# Altium schematic sheet RTC.SchDoc
size 297 x 209 mm; DocumentNumber: 6; SheetNumber: 6
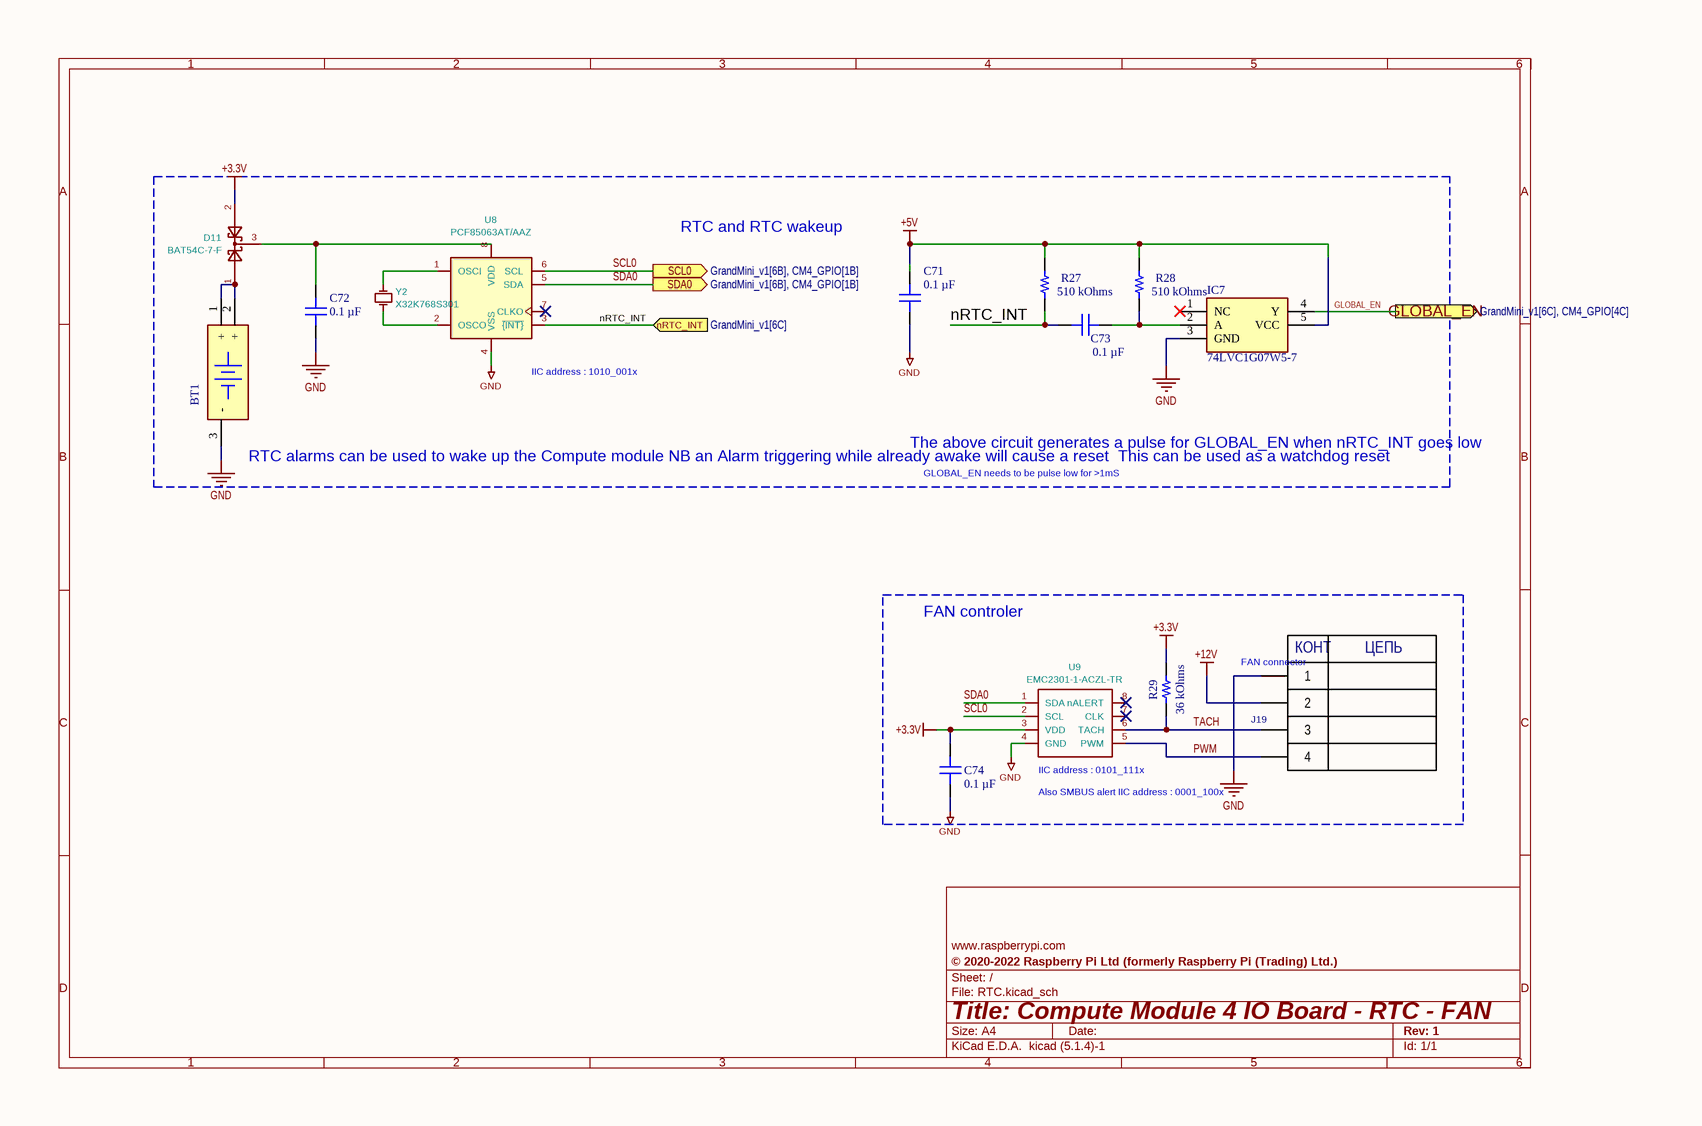
[diagram p0: RTC.SchDoc]

## Parts
BT1  CR2032 Holder  [KLS5CR203204]  (value not drawn)
C71  0.1 µF  [CAP 0603_1608]
C72  0.1 µF  [CAP 0603_1608]
C73  0.1 µF  [CAP 0603_1608]
C74  0.1 µF  [CAP 0603_1608]
D11  BAT54C-7-F  [SOT-23]
IC7  74LVC1G07W5-7  [SOT95P285X140-5N]
J19  WF-4  [WF-4]  (value not drawn)
R27  510 kOhms  [YAGEO RES 0603_1608]
R28  510 kOhms  [YAGEO RES 0603_1608]
R29  36 kOhms  [YAGEO RES 0603_1608]
U8  PCF85063AT/AAZ  [SOIC-8_3.9x4.9mm_P1.27mm]
U9  EMC2301-1-ACZL-TR  [MSOP-8_3x3mm_P0.65mm]
Y2  X32K768S301  [Crystal_SMD_3215-2Pin_3.2x1.5mm]

## Blocks framed on the sheet
RTC and RTC wakeup: BT1 C71-C73 D11 IC7 R27 R28 U8 Y2
FAN controler: C74 J19 R29 U9

## Ports
GLOBAL_EN (out, see GrandMini_v1[6C], CM4_GPIO[4C]), nRTC_INT (in, see GrandMini_v1[6C]), SCL0 (out, see GrandMini_v1[6B], CM4_GPIO[1B]), SDA0 (out, see GrandMini_v1[6B], CM4_GPIO[1B])

## Nets
+3.3V: C74.2 D11.2 R29.1 U9.3(VDD)
+5V: C71.2 IC7.5(VCC) R27.2 R28.2
+12V: J19.2
GND: BT1.3(-) C71.1 C72.1 C74.1 IC7.3(GND) J19.1 U8.4(VSS) U9.4(GND)
GLOBAL_EN: IC7.4(Y) ; port GLOBAL_EN
nRTC_INT: C73.1 R27.1 U8.3(~{{INT}}) ; port nRTC_INT
PWM: J19.4 U9.5(PWM)
SCL0: U8.6(SCL) U9.2(SCL) ; port SCL0
SDA0: U8.5(SDA) U9.1(SDA) ; port SDA0
TACH: J19.3 R29.2 U9.6(TACH)
NetBT1_1: BT1.1(+) BT1.2(+) D11.1
NetC72_2: C72.2 D11.3 U8.8(VDD)
NetC73_2: C73.2 IC7.2(A) R28.1
NetU8_1: U8.1(OSCI) Y2.2
NetU8_2: U8.2(OSCO) Y2.1

Not connected (* = marked no-connect by the designer): IC7 1(NC)*; U8 7(CLKO)*; U9 7(CLK)* 8(nALERT)*

## Notes on the sheet
- (near U8) IIC address : 1010_001x
- (near BT1) RTC alarms can be used to wake up the Compute module
  NB an Alarm triggering while already awake will cause a reset
  This can be used as a watchdog reset
- The above circuit generates a pulse for
  GLOBAL_EN when nRTC_INT goes low
- GLOBAL_EN needs to be pulse low for >1mS
- (near J19) FAN connector
- (near U9) IIC address : 0101_111x
- Also SMBUS alert IIC address : 0001_100x
- 1
- 2
- 3
- 4
- 5
- 6
- A
- B
- C
- www.raspberrypi.com <http://www.raspberrypi.com>
- D
- Title: Compute Module 4 IO Board - RTC - FAN
- File: RTC.kicad_sch
- Sheet: /
- © 2020-2022 Raspberry Pi Ltd (formerly Raspberry Pi (Trading) Ltd.)
- KiCad E.D.A.  kicad (5.1.4)-1
- Size: A4
- Date:
- Rev: 1
- Id: 1/1
- (in symbol WF-4) КОНТ; ЦЕПЬ

## Library data of the parts
BT1 = KLS5-CR2032-04: Battery Holder, Vertical, CR2032; Manufacturer_Name: KLS Electronic; Datasheet Link: http://www.klsele.com/admin/product_upload/20151124101114KLS5-CR2032-04.pdf; Height: 18.13mm; Manufacturer_Part_Number: KLS5-CR2032-04
C71-C74 = CC0603KRX7R9BB104: CAP CER 0.1UF 50V X7R 0603; manufacturer: Yageo; Tolerance: ±10%; Value: 0.1 µF; Part Number: CC0603KRX7R9BB104; Applications: General Purpose; Capacitance: 0.1 µF; componentlink1description: Datasheet; componentlink1url: https://www.yageo.com/upload/media/product/productsearch/datasheet/mlcc/UPY-GPHC_X7R_6.3V-to-50V_18.pdf; componentlink2description: DigiKey Link; componentlink2url: https://www.digikey.com/en/products/detail/yageo/CC0603KRX7R9BB104/2103082; Device Package: 0603 (1608 Metric); lastupdated: 09.02.2024 20:10:21; Lifecycle Status: Active; Minimum Order: 1; Mounting Type: Surface Mount, MLCC; Operating Temperature: -55°C ~ 125°C; Package / Case: 0603 (1608 Metric); packaging: TapeAndReel; partid: 9506; Part Status: Active; price: 0.01; series: CC; Size / Dimension: 0.063" L x 0.031" W (1.60mm x 0.80mm); Supplier 1: DigiKey; Supplier Part Number 1: 311-1344-1-ND; Temperature Coefficient: X7R; Thickness (Max): 0.035" (0.90mm); Voltage - Rated: 50V
D11 = BAT54C: Part Description: Diode Array 1 Pair Common Cathode Schottky 30V 200mA (DC) Surface Mount TO-236-3, SC-59, SOT-23-3; Field4: Farnell; Field5: 2306010; Field7: Rohm; Field6: BAT54C-7-F; Value: BAT54C-7-F; Footprint: Package_TO_SOT_SMD:SOT-23
IC7 = 74LVC1G07W5-7: Integrated Circuit; Manufacturer_Name: Diodes Incorporated; Datasheet Link: https://www.diodes.com//assets/Datasheets/74LVC1G07.pdf; Height: 1.4mm; Manufacturer_Part_Number: 74LVC1G07W5-7; Mouser Part Number: 621-74LVC1G07W5-7; Mouser Price/Stock: https://www.mouser.co.uk/ProductDetail/Diodes-Incorporated/74LVC1G07W5-7?qs=abZ1nkZpTuMhe1bWQEjvtw%3D%3D; Arrow Part Number: 74LVC1G07W5-7; Arrow Price/Stock: https://www.arrow.com/en/products/74lvc1g07w5-7/diodes-incorporated?utm_currency=USD&region=nac
J19 = WF-4: Connector; Manufacturer: Connfly; Part Number: WF-6; Part Number1: DS1070-6 M; System: Connector
R27 R28 = RC0603FR-07510KL: RES 510K OHM 1% 1/10W 0603; Manufacturer: Yageo; Power (Watts): 0.1W, 1/10W; Temperature Coefficient: ±100ppm/°C; Value: 510 kOhms; Part Number: RC0603FR-07510KL; ComponentLink1Description: Datasheet; ComponentLink1URL: https://www.yageo.com/upload/media/product/productsearch/datasheet/rchip/PYu-RC_Group_51_RoHS_L_10.pdf; ComponentLink2Description: DigiKey Link; ComponentLink2URL: https://www.digikey.com/en/products/detail/yageo/RC0603FR-07510KL/727286; Composition: Thick Film; Device Package: 0603 (1608 Metric); Features: Moisture Resistant; Height - Seated (Max): 0.022" (0.55mm); LastUpdated: 25.07.2024 9:19:27; Lifecycle Status: Active; Minimum Order: 1; Number of Terminations: 2; Operating Temperature: -55°C ~ 155°C; Package / Case: 0603 (1608 Metric); Packaging: CutTape; PartId: 12435; Part Status: Active; Price: 0.01; Resistance: 510 kOhms; Series: RC_L; Size / Dimension: 0.063" L x 0.031" W (1.60mm x 0.80mm); Supplier 1: DigiKey; Supplier Part Number 1: 311-510KHRCT-ND; Supplier Device Package: 0603; Tolerance: ±1%
R29 = RC0603FR-0736KL: RES 36K OHM 1% 1/10W 0603; Manufacturer: Yageo; Power (Watts): 0.1W, 1/10W; Temperature Coefficient: ±100ppm/°C; Value: 36 kOhms; Part Number: RC0603FR-0736KL; ComponentLink1Description: Datasheet; ComponentLink1URL: https://www.yageo.com/upload/media/product/productsearch/datasheet/rchip/PYu-RC_Group_51_RoHS_L_10.pdf; ComponentLink2Description: DigiKey Link; ComponentLink2URL: https://www.digikey.com/en/products/detail/yageo/RC0603FR-0736KL/727179; Composition: Thick Film; Device Package: 0603 (1608 Metric); Features: Moisture Resistant; Height - Seated (Max): 0.022" (0.55mm); LastUpdated: 25.07.2024 9:19:21; Lifecycle Status: Active; Minimum Order: 1; Number of Terminations: 2; Operating Temperature: -55°C ~ 155°C; Package / Case: 0603 (1608 Metric); Packaging: CutTape; PartId: 19090; Part Status: Active; Price: 0.01; Resistance: 36 kOhms; Series: RC_L; Size / Dimension: 0.063" L x 0.031" W (1.60mm x 0.80mm); Supplier 1: DigiKey; Supplier Part Number 1: 311-36.0KHRCT-ND; Supplier Device Package: 0603; Tolerance: ±1%
U8 = PCF8563T: Part Description: Real Time Clock (RTC) IC Clock/Calendar I²C, 2-Wire Serial 8-SOIC (0.154", 3.90mm Width); Field4: Farnell; Field5: 2890042; Field7: NXP; Field6: PCF85063AT/AAZ; Value: PCF85063AT/AAZ; Footprint: Package_SO:SOIC-8_3.9x4.9mm_P1.27mm
U9 = EMC2301: Part Description: Motor Driver PWM 8-MSOP; Field4: Digikey; Field5: EMC2301-1-ACZL-CT-ND; Field7: Microchip; Field6: EMC2301-1-ACZL-TR; Value: EMC2301-1-ACZL-TR; Footprint: Package_SO:MSOP-8_3x3mm_P0.65mm
Y2 = Crystal_Small: Part Description: Crystal 32.768KHz 7pF 20pmm; Field7: AEL; Field6: X32K768S301; Value: X32K768S301; Footprint: Crystal:Crystal_SMD_3215-2Pin_3.2x1.5mm